# Altium schematic sheet BLOCK DIAGRAM.SchDoc
size A1; DocumentNumber: 14; SheetNumber: 1; SheetTotal: 14
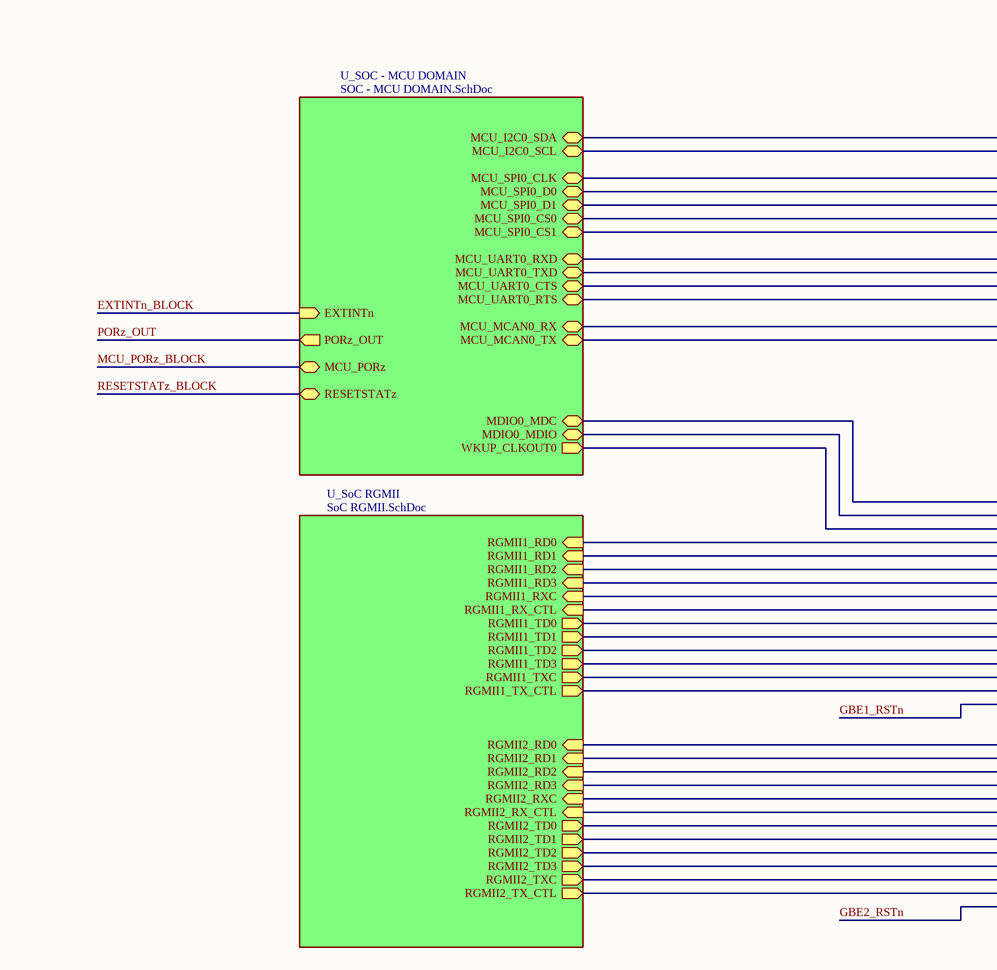
[diagram p0: BLOCK DIAGRAM.SchDoc, top left]
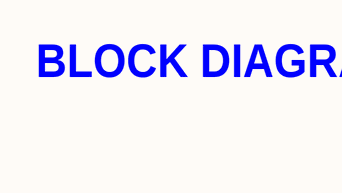
[diagram p1: BLOCK DIAGRAM.SchDoc, top right]
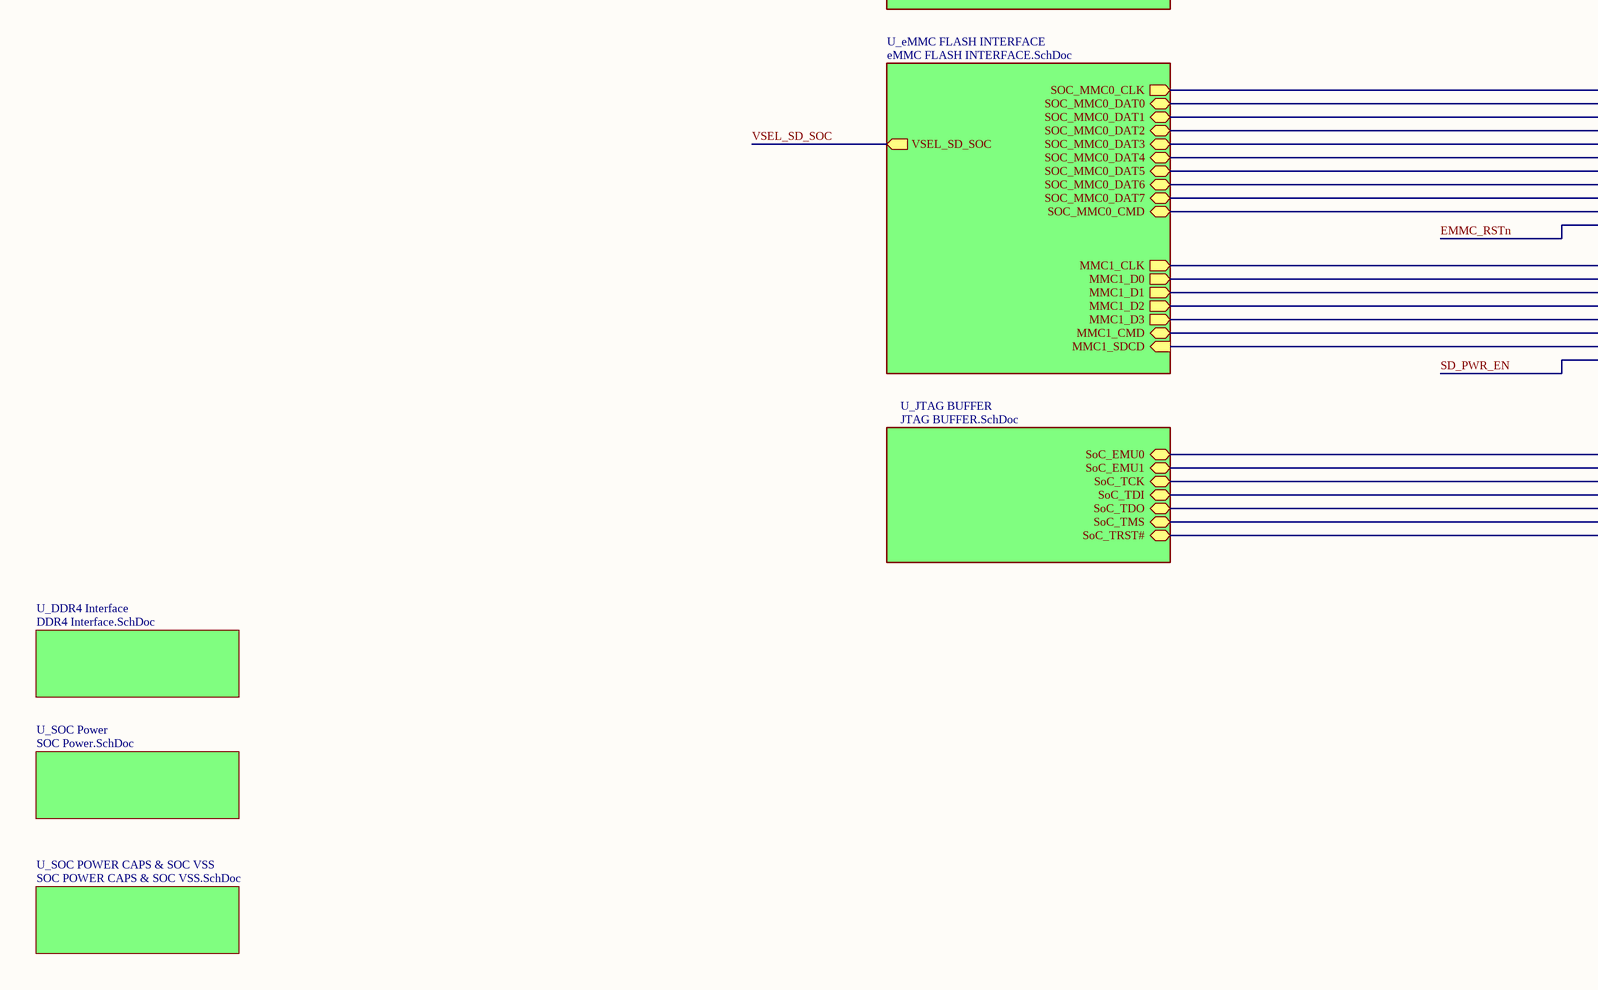
[diagram p2: BLOCK DIAGRAM.SchDoc, bottom left]
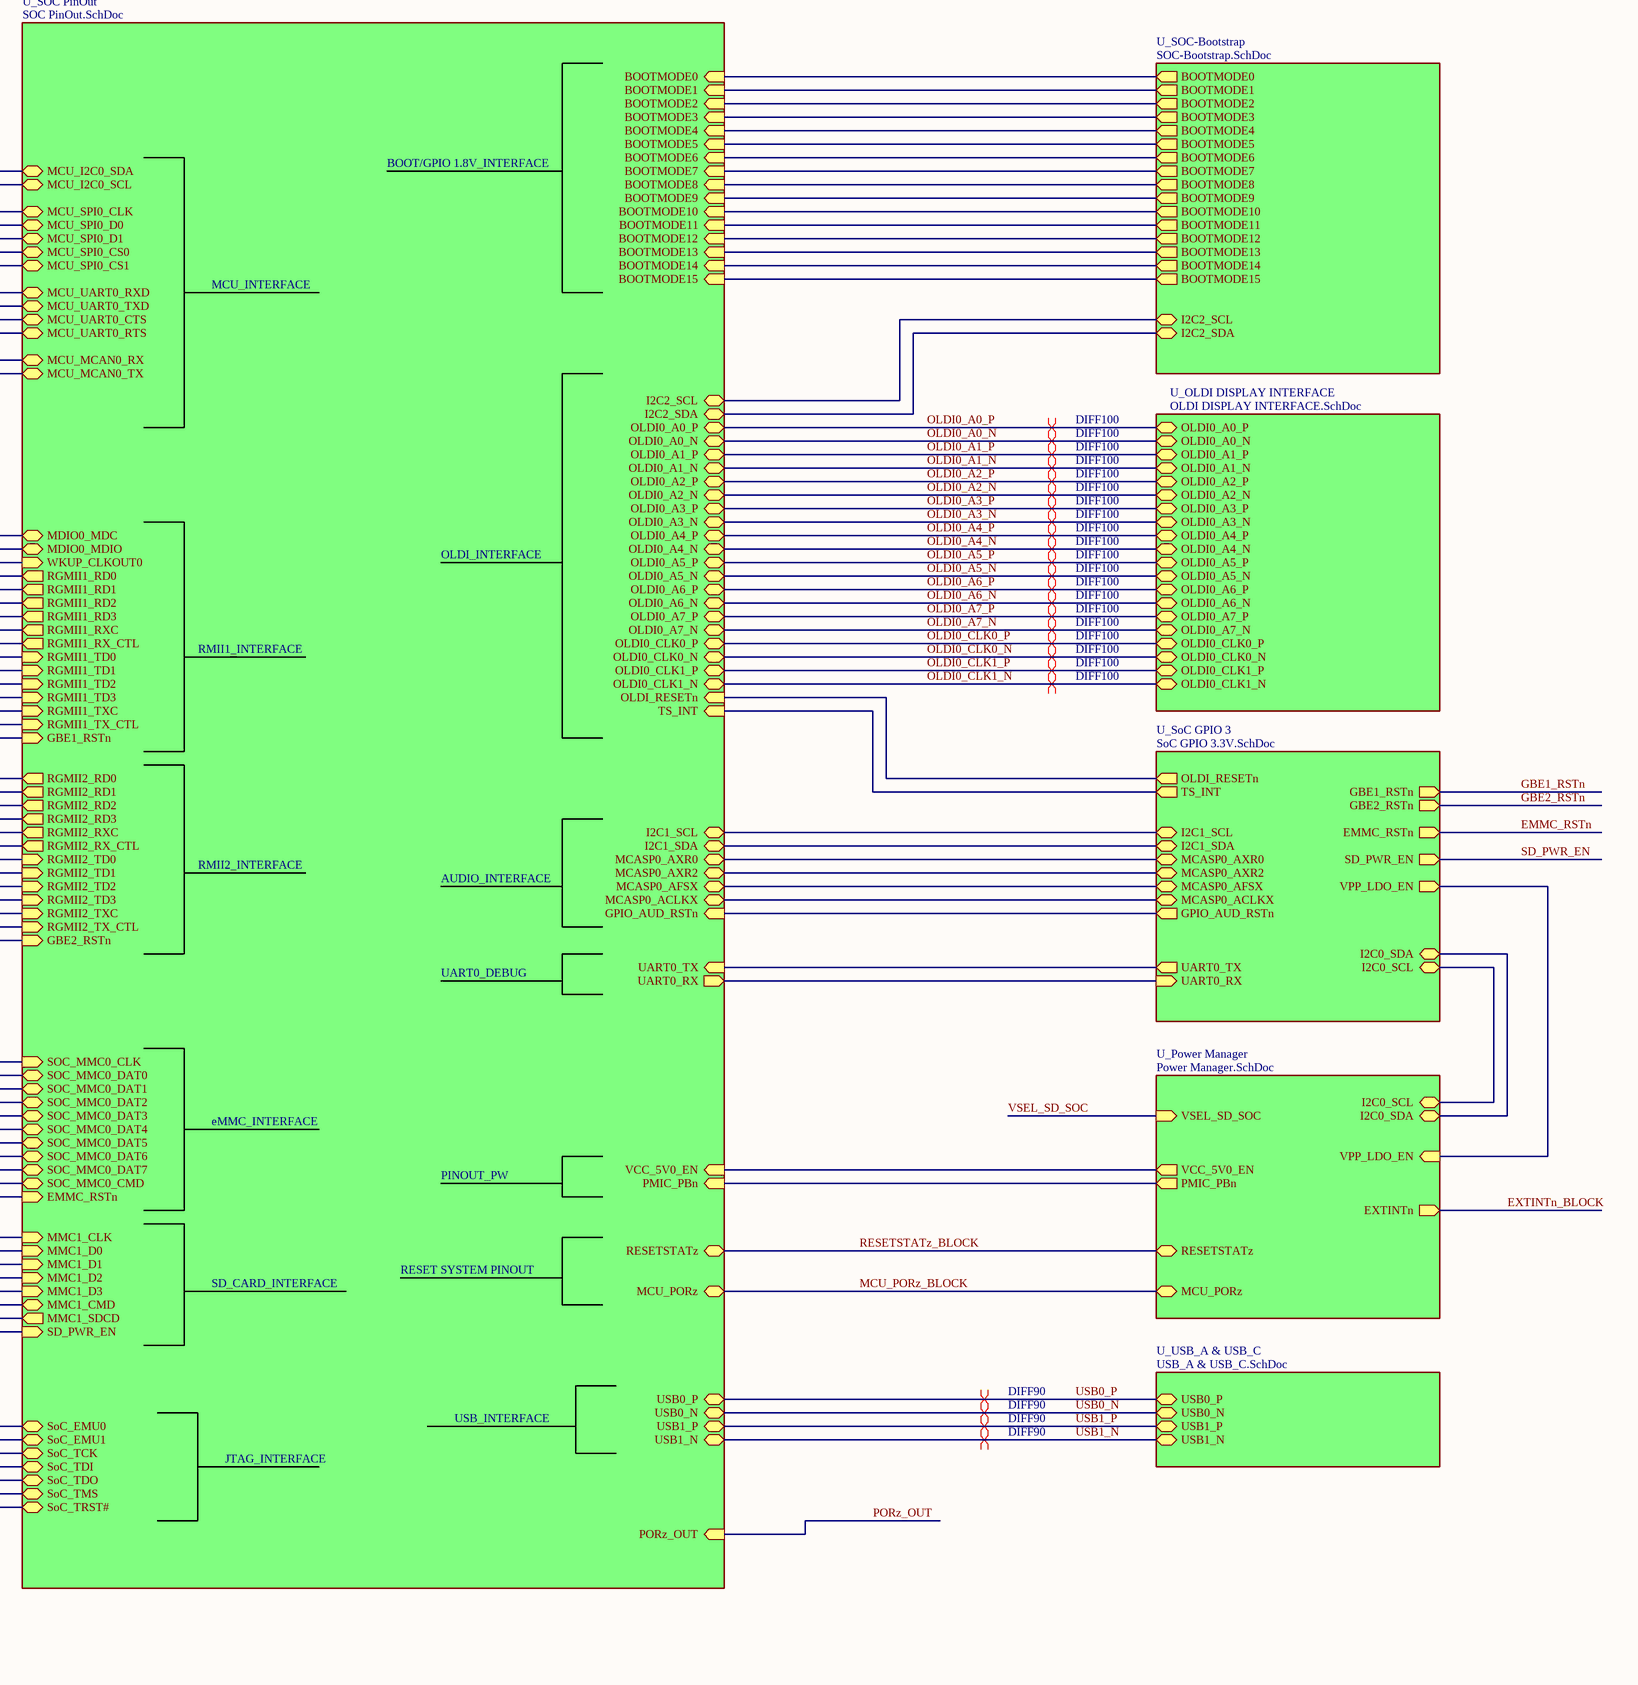
[diagram p3: BLOCK DIAGRAM.SchDoc, bottom right]

## Sub-sheets
U_DDR4 Interface = DDR4 Interface.SchDoc: no entries
U_eMMC FLASH INTERFACE = eMMC FLASH INTERFACE.SchDoc: SOC_MMC0_CLK (out), SOC_MMC0_DAT0 (bidir), SOC_MMC0_DAT1 (bidir), SOC_MMC0_DAT2 (bidir), SOC_MMC0_DAT3 (bidir), SOC_MMC0_DAT4 (bidir), SOC_MMC0_DAT5 (bidir), SOC_MMC0_DAT6 (bidir), SOC_MMC0_DAT7 (bidir), SOC_MMC0_CMD (bidir), VSEL_SD_SOC (out), MMC1_CMD (bidir), MMC1_D1 (out), MMC1_D0 (out), MMC1_SDCD (in), MMC1_D3 (out), MMC1_CLK (out), MMC1_D2 (out)
U_JTAG BUFFER = JTAG BUFFER.SchDoc: SoC_EMU0 (bidir), SoC_EMU1 (bidir), SoC_TCK (bidir), SoC_TDI (bidir), SoC_TDO (bidir), SoC_TMS (bidir), SoC_TRST# (bidir)
U_OLDI DISPLAY INTERFACE = OLDI DISPLAY INTERFACE.SchDoc: OLDI0_A0_P (bidir), OLDI0_A0_N (bidir), OLDI0_A1_P (bidir), OLDI0_A1_N (bidir), OLDI0_A2_P (bidir), OLDI0_A2_N (bidir), OLDI0_A3_P (bidir), OLDI0_A3_N (bidir), OLDI0_A4_P (bidir), OLDI0_A4_N (bidir), OLDI0_A5_P (bidir), OLDI0_A5_N (bidir), OLDI0_A6_P (bidir), OLDI0_A6_N (bidir), OLDI0_A7_P (bidir), OLDI0_A7_N (bidir), OLDI0_CLK0_P (bidir), OLDI0_CLK0_N (bidir), OLDI0_CLK1_P (bidir), OLDI0_CLK1_N (bidir)
U_Power Manager = Power Manager.SchDoc: VCC_5V0_EN (out), VSEL_SD_SOC (in), RESETSTATz (bidir), VPP_LDO_EN (in), MCU_PORz (bidir), EXTINTn (out), I2C0_SDA (bidir), I2C0_SCL (bidir), PMIC_PBn (out)
U_SOC - MCU DOMAIN = SOC - MCU DOMAIN.SchDoc: MDIO0_MDC (bidir), MDIO0_MDIO (bidir), WKUP_CLKOUT0 (out), MCU_I2C0_SCL (bidir), MCU_I2C0_SDA (bidir), MCU_SPI0_CLK (bidir), MCU_SPI0_D0 (bidir), MCU_SPI0_D1 (bidir), MCU_SPI0_CS0 (bidir), MCU_SPI0_CS1 (bidir), MCU_UART0_RXD (bidir), MCU_UART0_TXD (bidir), MCU_UART0_CTS (bidir), MCU_UART0_RTS (bidir), MCU_MCAN0_RX (bidir), MCU_MCAN0_TX (bidir), MCU_PORz (bidir), EXTINTn (in), PORz_OUT (out), RESETSTATz (bidir)
U_SoC GPIO 3 = SoC GPIO 3.3V.SchDoc: OLDI_RESETn (out), I2C0_SDA (bidir), I2C0_SCL (bidir), I2C1_SDA (bidir), I2C1_SCL (bidir), EMMC_RSTn (out), VPP_LDO_EN (out), MCASP0_ACLKX (bidir), MCASP0_AXR2 (bidir), MCASP0_AXR0 (bidir), MCASP0_AFSX (bidir), GPIO_AUD_RSTn (out), TS_INT (out), UART0_RX (in), UART0_TX (out), SD_PWR_EN (out), GBE2_RSTn (out), GBE1_RSTn (out)
U_SOC PinOut = SOC PinOut.SchDoc: VCC_5V0_EN (in), SOC_MMC0_CLK (in), SOC_MMC0_DAT0 (bidir), SOC_MMC0_DAT1 (bidir), SOC_MMC0_DAT2 (bidir), SOC_MMC0_DAT3 (bidir), SOC_MMC0_DAT4 (bidir), SOC_MMC0_DAT5 (bidir), SOC_MMC0_DAT6 (bidir), SOC_MMC0_DAT7 (bidir), SOC_MMC0_CMD (bidir), EMMC_RSTn (in), SoC_EMU0 (bidir), SoC_EMU1 (bidir), SoC_TCK (bidir), SoC_TDO (bidir), SoC_TRST# (bidir), MCU_I2C0_SCL (bidir), MCU_I2C0_SDA (bidir), MCU_SPI0_CLK (bidir), MCU_SPI0_D0 (bidir), MCU_SPI0_D1 (bidir), MCU_SPI0_CS0 (bidir), MCU_SPI0_CS1 (bidir), MCU_UART0_RXD (bidir), MCU_UART0_TXD (bidir), MCU_UART0_CTS (bidir), MCU_UART0_RTS (bidir), MCU_MCAN0_RX (bidir), MCU_MCAN0_TX (bidir), OLDI0_A0_P (bidir), OLDI0_A0_N (bidir), OLDI0_A1_P (bidir), OLDI0_A1_N (bidir), OLDI0_A2_P (bidir), OLDI0_A2_N (bidir), OLDI0_A3_P (bidir), OLDI0_A3_N (bidir), OLDI0_A4_P (bidir), OLDI0_A4_N (bidir), OLDI0_A5_P (bidir), OLDI0_A5_N (bidir), OLDI0_A6_P (bidir), OLDI0_A6_N (bidir), OLDI0_A7_P (bidir), OLDI0_A7_N (bidir), OLDI0_CLK0_P (bidir), OLDI0_CLK0_N (bidir), OLDI0_CLK1_P (bidir), OLDI0_CLK1_N (bidir), I2C2_SCL (bidir), I2C2_SDA (bidir), RGMII1_RD0 (out), RGMII1_RD1 (out), RGMII1_RD2 (out), RGMII1_RD3 (out), RGMII1_RXC (out), RGMII1_RX_CTL (out), RGMII1_TD0 (in), RGMII1_TXC (in), RGMII1_TX_CTL (in), RGMII1_TD1 (in), RGMII1_TD2 (in), RGMII1_TD3 (in), MDIO0_MDC (bidir), MDIO0_MDIO (bidir), WKUP_CLKOUT0 (in), BOOTMODE0 (in), BOOTMODE1 (in), BOOTMODE2 (in), BOOTMODE3 (in), BOOTMODE4 (in), BOOTMODE5 (in), BOOTMODE6 (in), BOOTMODE7 (in), BOOTMODE8 (in), BOOTMODE9 (in), BOOTMODE10 (in), BOOTMODE11 (in), BOOTMODE12 (in), BOOTMODE13 (in), BOOTMODE14 (in), BOOTMODE15 (in), PORz_OUT (in), RESETSTATz (bidir), USB0_P (bidir), USB0_N (bidir), I2C1_SDA (bidir), I2C1_SCL (bidir), MCASP0_ACLKX (bidir), MCASP0_AXR2 (bidir), MCASP0_AXR0 (bidir), MCASP0_AFSX (bidir), GPIO_AUD_RSTn (in), USB1_P (bidir), USB1_N (bidir), OLDI_RESETn (in), TS_INT (in), UART0_RX (out), UART0_TX (in), RGMII2_TD0 (in), MMC1_CLK (in), RGMII2_RD3 (out), MMC1_D3 (in), MMC1_CMD (bidir), RGMII2_RD0 (out), MMC1_D1 (in), RGMII2_RX_CTL (out), RGMII2_TXC (in), SD_PWR_EN (in), MMC1_D2 (in), MMC1_SDCD (out), RGMII2_RXC (out), RGMII2_RD2 (out), GBE2_RSTn (in), RGMII2_TD2 (in), RGMII2_TD1 (in), RGMII2_TX_CTL (in), MCU_PORz (bidir), RGMII2_TD3 (in), MMC1_D0 (in), RGMII2_RD1 (out), GBE1_RSTn (in), SoC_TDI (bidir), SoC_TMS (bidir), PMIC_PBn (in)
U_SOC Power = SOC Power.SchDoc: no entries
U_SOC POWER CAPS & SOC VSS = SOC POWER CAPS & SOC VSS.SchDoc: no entries
U_SoC RGMII = SoC RGMII.SchDoc: RGMII1_RD0 (in), RGMII1_RD1 (in), RGMII1_RD2 (in), RGMII1_RD3 (in), RGMII1_RXC (in), RGMII1_RX_CTL (in), RGMII1_TD0 (out), RGMII1_TXC (out), RGMII1_TX_CTL (out), RGMII1_TD1 (out), RGMII1_TD2 (out), RGMII1_TD3 (out), RGMII2_RD1 (in), RGMII2_RD0 (in), RGMII2_RXC (in), RGMII2_RD2 (in), RGMII2_TX_CTL (out), RGMII2_TD2 (out), RGMII2_RX_CTL (in), RGMII2_TD1 (out), RGMII2_TD0 (out), RGMII2_TXC (out), RGMII2_TD3 (out), RGMII2_RD3 (in)
U_SOC-Bootstrap = SOC-Bootstrap.SchDoc: BOOTMODE0 (out), BOOTMODE1 (out), BOOTMODE2 (out), BOOTMODE3 (out), BOOTMODE4 (out), BOOTMODE5 (out), BOOTMODE6 (out), BOOTMODE7 (out), BOOTMODE8 (out), BOOTMODE9 (out), BOOTMODE10 (out), BOOTMODE11 (out), BOOTMODE12 (out), BOOTMODE13 (out), BOOTMODE14 (out), BOOTMODE15 (out), I2C2_SCL (bidir), I2C2_SDA (bidir)
U_USB_A & USB_C = USB_A & USB_C.SchDoc: USB0_P (bidir), USB0_N (bidir), USB1_P (bidir), USB1_N (bidir)

## Nets
EMMC_RSTn: sheet U_SOC PinOut/EMMC_RSTn, sheet U_SoC GPIO 3/EMMC_RSTn
EXTINTn_BLOCK: sheet U_Power Manager/EXTINTn, sheet U_SOC - MCU DOMAIN/EXTINTn
GBE1_RSTn: sheet U_SOC PinOut/GBE1_RSTn, sheet U_SoC GPIO 3/GBE1_RSTn
GBE2_RSTn: sheet U_SOC PinOut/GBE2_RSTn, sheet U_SoC GPIO 3/GBE2_RSTn
MCU_PORz_BLOCK: sheet U_Power Manager/MCU_PORz, sheet U_SOC - MCU DOMAIN/MCU_PORz, sheet U_SOC PinOut/MCU_PORz
OLDI0_A0_N: sheet U_SOC PinOut/OLDI0_A0_N, sheet U_OLDI DISPLAY INTERFACE/OLDI0_A0_N
OLDI0_A0_P: sheet U_SOC PinOut/OLDI0_A0_P, sheet U_OLDI DISPLAY INTERFACE/OLDI0_A0_P
OLDI0_A1_N: sheet U_SOC PinOut/OLDI0_A1_N, sheet U_OLDI DISPLAY INTERFACE/OLDI0_A1_N
OLDI0_A1_P: sheet U_SOC PinOut/OLDI0_A1_P, sheet U_OLDI DISPLAY INTERFACE/OLDI0_A1_P
OLDI0_A2_N: sheet U_SOC PinOut/OLDI0_A2_N, sheet U_OLDI DISPLAY INTERFACE/OLDI0_A2_N
OLDI0_A2_P: sheet U_SOC PinOut/OLDI0_A2_P, sheet U_OLDI DISPLAY INTERFACE/OLDI0_A2_P
OLDI0_A3_N: sheet U_SOC PinOut/OLDI0_A3_N, sheet U_OLDI DISPLAY INTERFACE/OLDI0_A3_N
OLDI0_A3_P: sheet U_SOC PinOut/OLDI0_A3_P, sheet U_OLDI DISPLAY INTERFACE/OLDI0_A3_P
OLDI0_A4_N: sheet U_SOC PinOut/OLDI0_A4_N, sheet U_OLDI DISPLAY INTERFACE/OLDI0_A4_N
OLDI0_A4_P: sheet U_SOC PinOut/OLDI0_A4_P, sheet U_OLDI DISPLAY INTERFACE/OLDI0_A4_P
OLDI0_A5_N: sheet U_SOC PinOut/OLDI0_A5_N, sheet U_OLDI DISPLAY INTERFACE/OLDI0_A5_N
OLDI0_A5_P: sheet U_SOC PinOut/OLDI0_A5_P, sheet U_OLDI DISPLAY INTERFACE/OLDI0_A5_P
OLDI0_A6_N: sheet U_SOC PinOut/OLDI0_A6_N, sheet U_OLDI DISPLAY INTERFACE/OLDI0_A6_N
OLDI0_A6_P: sheet U_SOC PinOut/OLDI0_A6_P, sheet U_OLDI DISPLAY INTERFACE/OLDI0_A6_P
OLDI0_A7_N: sheet U_SOC PinOut/OLDI0_A7_N, sheet U_OLDI DISPLAY INTERFACE/OLDI0_A7_N
OLDI0_A7_P: sheet U_SOC PinOut/OLDI0_A7_P, sheet U_OLDI DISPLAY INTERFACE/OLDI0_A7_P
OLDI0_CLK0_N: sheet U_SOC PinOut/OLDI0_CLK0_N, sheet U_OLDI DISPLAY INTERFACE/OLDI0_CLK0_N
OLDI0_CLK0_P: sheet U_SOC PinOut/OLDI0_CLK0_P, sheet U_OLDI DISPLAY INTERFACE/OLDI0_CLK0_P
OLDI0_CLK1_N: sheet U_SOC PinOut/OLDI0_CLK1_N, sheet U_OLDI DISPLAY INTERFACE/OLDI0_CLK1_N
OLDI0_CLK1_P: sheet U_SOC PinOut/OLDI0_CLK1_P, sheet U_OLDI DISPLAY INTERFACE/OLDI0_CLK1_P
PORz_OUT: sheet U_SOC - MCU DOMAIN/PORz_OUT, sheet U_SOC PinOut/PORz_OUT
RESETSTATz_BLOCK: sheet U_Power Manager/RESETSTATz, sheet U_SOC - MCU DOMAIN/RESETSTATz, sheet U_SOC PinOut/RESETSTATz
SD_PWR_EN: sheet U_SOC PinOut/SD_PWR_EN, sheet U_SoC GPIO 3/SD_PWR_EN
USB0_N: sheet U_SOC PinOut/USB0_N, sheet U_USB_A & USB_C/USB0_N
USB0_P: sheet U_SOC PinOut/USB0_P, sheet U_USB_A & USB_C/USB0_P
USB1_N: sheet U_SOC PinOut/USB1_N, sheet U_USB_A & USB_C/USB1_N
USB1_P: sheet U_SOC PinOut/USB1_P, sheet U_USB_A & USB_C/USB1_P
VSEL_SD_SOC: sheet U_Power Manager/VSEL_SD_SOC, sheet U_eMMC FLASH INTERFACE/VSEL_SD_SOC
(unnamed): sheet U_Power Manager/VCC_5V0_EN, sheet U_SOC PinOut/VCC_5V0_EN
(unnamed): sheet U_Power Manager/VPP_LDO_EN, sheet U_SoC GPIO 3/VPP_LDO_EN
(unnamed): sheet U_Power Manager/I2C0_SDA, sheet U_SoC GPIO 3/I2C0_SDA
(unnamed): sheet U_Power Manager/I2C0_SCL, sheet U_SoC GPIO 3/I2C0_SCL
(unnamed): sheet U_Power Manager/PMIC_PBn, sheet U_SOC PinOut/PMIC_PBn
(unnamed): sheet U_SOC - MCU DOMAIN/MDIO0_MDC, sheet U_SOC PinOut/MDIO0_MDC
(unnamed): sheet U_SOC - MCU DOMAIN/MDIO0_MDIO, sheet U_SOC PinOut/MDIO0_MDIO
(unnamed): sheet U_SOC - MCU DOMAIN/WKUP_CLKOUT0, sheet U_SOC PinOut/WKUP_CLKOUT0
(unnamed): sheet U_SOC - MCU DOMAIN/MCU_I2C0_SCL, sheet U_SOC PinOut/MCU_I2C0_SCL
(unnamed): sheet U_SOC - MCU DOMAIN/MCU_I2C0_SDA, sheet U_SOC PinOut/MCU_I2C0_SDA
(unnamed): sheet U_SOC - MCU DOMAIN/MCU_SPI0_CLK, sheet U_SOC PinOut/MCU_SPI0_CLK
(unnamed): sheet U_SOC - MCU DOMAIN/MCU_SPI0_D0, sheet U_SOC PinOut/MCU_SPI0_D0
(unnamed): sheet U_SOC - MCU DOMAIN/MCU_SPI0_D1, sheet U_SOC PinOut/MCU_SPI0_D1
(unnamed): sheet U_SOC - MCU DOMAIN/MCU_SPI0_CS0, sheet U_SOC PinOut/MCU_SPI0_CS0
(unnamed): sheet U_SOC - MCU DOMAIN/MCU_SPI0_CS1, sheet U_SOC PinOut/MCU_SPI0_CS1
(unnamed): sheet U_SOC - MCU DOMAIN/MCU_UART0_RXD, sheet U_SOC PinOut/MCU_UART0_RXD
(unnamed): sheet U_SOC - MCU DOMAIN/MCU_UART0_TXD, sheet U_SOC PinOut/MCU_UART0_TXD
(unnamed): sheet U_SOC - MCU DOMAIN/MCU_UART0_CTS, sheet U_SOC PinOut/MCU_UART0_CTS
(unnamed): sheet U_SOC - MCU DOMAIN/MCU_UART0_RTS, sheet U_SOC PinOut/MCU_UART0_RTS
(unnamed): sheet U_SOC - MCU DOMAIN/MCU_MCAN0_RX, sheet U_SOC PinOut/MCU_MCAN0_RX
(unnamed): sheet U_SOC - MCU DOMAIN/MCU_MCAN0_TX, sheet U_SOC PinOut/MCU_MCAN0_TX
(unnamed): sheet U_SOC PinOut/SOC_MMC0_CLK, sheet U_eMMC FLASH INTERFACE/SOC_MMC0_CLK
(unnamed): sheet U_SOC PinOut/SOC_MMC0_DAT0, sheet U_eMMC FLASH INTERFACE/SOC_MMC0_DAT0
(unnamed): sheet U_SOC PinOut/SOC_MMC0_DAT1, sheet U_eMMC FLASH INTERFACE/SOC_MMC0_DAT1
(unnamed): sheet U_SOC PinOut/SOC_MMC0_DAT2, sheet U_eMMC FLASH INTERFACE/SOC_MMC0_DAT2
(unnamed): sheet U_SOC PinOut/SOC_MMC0_DAT3, sheet U_eMMC FLASH INTERFACE/SOC_MMC0_DAT3
(unnamed): sheet U_SOC PinOut/SOC_MMC0_DAT4, sheet U_eMMC FLASH INTERFACE/SOC_MMC0_DAT4
(unnamed): sheet U_SOC PinOut/SOC_MMC0_DAT5, sheet U_eMMC FLASH INTERFACE/SOC_MMC0_DAT5
(unnamed): sheet U_SOC PinOut/SOC_MMC0_DAT6, sheet U_eMMC FLASH INTERFACE/SOC_MMC0_DAT6
(unnamed): sheet U_SOC PinOut/SOC_MMC0_DAT7, sheet U_eMMC FLASH INTERFACE/SOC_MMC0_DAT7
(unnamed): sheet U_SOC PinOut/SOC_MMC0_CMD, sheet U_eMMC FLASH INTERFACE/SOC_MMC0_CMD
(unnamed): sheet U_SOC PinOut/SoC_EMU0, sheet U_JTAG BUFFER/SoC_EMU0
(unnamed): sheet U_SOC PinOut/SoC_EMU1, sheet U_JTAG BUFFER/SoC_EMU1
(unnamed): sheet U_SOC PinOut/SoC_TCK, sheet U_JTAG BUFFER/SoC_TCK
(unnamed): sheet U_SOC PinOut/SoC_TDO, sheet U_JTAG BUFFER/SoC_TDO
(unnamed): sheet U_SOC PinOut/SoC_TRST#, sheet U_JTAG BUFFER/SoC_TRST#
(unnamed): sheet U_SOC PinOut/I2C2_SCL, sheet U_SOC-Bootstrap/I2C2_SCL
(unnamed): sheet U_SOC PinOut/I2C2_SDA, sheet U_SOC-Bootstrap/I2C2_SDA
(unnamed): sheet U_SOC PinOut/RGMII1_RD0, sheet U_SoC RGMII/RGMII1_RD0
(unnamed): sheet U_SOC PinOut/RGMII1_RD1, sheet U_SoC RGMII/RGMII1_RD1
(unnamed): sheet U_SOC PinOut/RGMII1_RD2, sheet U_SoC RGMII/RGMII1_RD2
(unnamed): sheet U_SOC PinOut/RGMII1_RD3, sheet U_SoC RGMII/RGMII1_RD3
(unnamed): sheet U_SOC PinOut/RGMII1_RXC, sheet U_SoC RGMII/RGMII1_RXC
(unnamed): sheet U_SOC PinOut/RGMII1_RX_CTL, sheet U_SoC RGMII/RGMII1_RX_CTL
(unnamed): sheet U_SOC PinOut/RGMII1_TD0, sheet U_SoC RGMII/RGMII1_TD0
(unnamed): sheet U_SOC PinOut/RGMII1_TXC, sheet U_SoC RGMII/RGMII1_TXC
(unnamed): sheet U_SOC PinOut/RGMII1_TX_CTL, sheet U_SoC RGMII/RGMII1_TX_CTL
(unnamed): sheet U_SOC PinOut/RGMII1_TD1, sheet U_SoC RGMII/RGMII1_TD1
(unnamed): sheet U_SOC PinOut/RGMII1_TD2, sheet U_SoC RGMII/RGMII1_TD2
(unnamed): sheet U_SOC PinOut/RGMII1_TD3, sheet U_SoC RGMII/RGMII1_TD3
(unnamed): sheet U_SOC PinOut/BOOTMODE0, sheet U_SOC-Bootstrap/BOOTMODE0
(unnamed): sheet U_SOC PinOut/BOOTMODE1, sheet U_SOC-Bootstrap/BOOTMODE1
(unnamed): sheet U_SOC PinOut/BOOTMODE2, sheet U_SOC-Bootstrap/BOOTMODE2
(unnamed): sheet U_SOC PinOut/BOOTMODE3, sheet U_SOC-Bootstrap/BOOTMODE3
(unnamed): sheet U_SOC PinOut/BOOTMODE4, sheet U_SOC-Bootstrap/BOOTMODE4
(unnamed): sheet U_SOC PinOut/BOOTMODE5, sheet U_SOC-Bootstrap/BOOTMODE5
(unnamed): sheet U_SOC PinOut/BOOTMODE6, sheet U_SOC-Bootstrap/BOOTMODE6
(unnamed): sheet U_SOC PinOut/BOOTMODE7, sheet U_SOC-Bootstrap/BOOTMODE7
(unnamed): sheet U_SOC PinOut/BOOTMODE8, sheet U_SOC-Bootstrap/BOOTMODE8
(unnamed): sheet U_SOC PinOut/BOOTMODE9, sheet U_SOC-Bootstrap/BOOTMODE9
(unnamed): sheet U_SOC PinOut/BOOTMODE10, sheet U_SOC-Bootstrap/BOOTMODE10
(unnamed): sheet U_SOC PinOut/BOOTMODE11, sheet U_SOC-Bootstrap/BOOTMODE11
(unnamed): sheet U_SOC PinOut/BOOTMODE12, sheet U_SOC-Bootstrap/BOOTMODE12
(unnamed): sheet U_SOC PinOut/BOOTMODE13, sheet U_SOC-Bootstrap/BOOTMODE13
(unnamed): sheet U_SOC PinOut/BOOTMODE14, sheet U_SOC-Bootstrap/BOOTMODE14
(unnamed): sheet U_SOC PinOut/BOOTMODE15, sheet U_SOC-Bootstrap/BOOTMODE15
(unnamed): sheet U_SOC PinOut/I2C1_SDA, sheet U_SoC GPIO 3/I2C1_SDA
(unnamed): sheet U_SOC PinOut/I2C1_SCL, sheet U_SoC GPIO 3/I2C1_SCL
(unnamed): sheet U_SOC PinOut/MCASP0_ACLKX, sheet U_SoC GPIO 3/MCASP0_ACLKX
(unnamed): sheet U_SOC PinOut/MCASP0_AXR2, sheet U_SoC GPIO 3/MCASP0_AXR2
(unnamed): sheet U_SOC PinOut/MCASP0_AXR0, sheet U_SoC GPIO 3/MCASP0_AXR0
(unnamed): sheet U_SOC PinOut/MCASP0_AFSX, sheet U_SoC GPIO 3/MCASP0_AFSX
(unnamed): sheet U_SOC PinOut/GPIO_AUD_RSTn, sheet U_SoC GPIO 3/GPIO_AUD_RSTn
(unnamed): sheet U_SOC PinOut/OLDI_RESETn, sheet U_SoC GPIO 3/OLDI_RESETn
(unnamed): sheet U_SOC PinOut/TS_INT, sheet U_SoC GPIO 3/TS_INT
(unnamed): sheet U_SOC PinOut/UART0_RX, sheet U_SoC GPIO 3/UART0_RX
(unnamed): sheet U_SOC PinOut/UART0_TX, sheet U_SoC GPIO 3/UART0_TX
(unnamed): sheet U_SOC PinOut/RGMII2_TD0, sheet U_SoC RGMII/RGMII2_TD0
(unnamed): sheet U_SOC PinOut/MMC1_CLK, sheet U_eMMC FLASH INTERFACE/MMC1_CLK
(unnamed): sheet U_SOC PinOut/RGMII2_RD3, sheet U_SoC RGMII/RGMII2_RD3
(unnamed): sheet U_SOC PinOut/MMC1_D3, sheet U_eMMC FLASH INTERFACE/MMC1_D3
(unnamed): sheet U_SOC PinOut/MMC1_CMD, sheet U_eMMC FLASH INTERFACE/MMC1_CMD
(unnamed): sheet U_SOC PinOut/RGMII2_RD0, sheet U_SoC RGMII/RGMII2_RD0
(unnamed): sheet U_SOC PinOut/MMC1_D1, sheet U_eMMC FLASH INTERFACE/MMC1_D1
(unnamed): sheet U_SOC PinOut/RGMII2_RX_CTL, sheet U_SoC RGMII/RGMII2_RX_CTL
(unnamed): sheet U_SOC PinOut/RGMII2_TXC, sheet U_SoC RGMII/RGMII2_TXC
(unnamed): sheet U_SOC PinOut/MMC1_D2, sheet U_eMMC FLASH INTERFACE/MMC1_D2
(unnamed): sheet U_SOC PinOut/MMC1_SDCD, sheet U_eMMC FLASH INTERFACE/MMC1_SDCD
(unnamed): sheet U_SOC PinOut/RGMII2_RXC, sheet U_SoC RGMII/RGMII2_RXC
(unnamed): sheet U_SOC PinOut/RGMII2_RD2, sheet U_SoC RGMII/RGMII2_RD2
(unnamed): sheet U_SOC PinOut/RGMII2_TD2, sheet U_SoC RGMII/RGMII2_TD2
(unnamed): sheet U_SOC PinOut/RGMII2_TD1, sheet U_SoC RGMII/RGMII2_TD1
(unnamed): sheet U_SOC PinOut/RGMII2_TX_CTL, sheet U_SoC RGMII/RGMII2_TX_CTL
(unnamed): sheet U_SOC PinOut/RGMII2_TD3, sheet U_SoC RGMII/RGMII2_TD3
(unnamed): sheet U_SOC PinOut/MMC1_D0, sheet U_eMMC FLASH INTERFACE/MMC1_D0
(unnamed): sheet U_SOC PinOut/RGMII2_RD1, sheet U_SoC RGMII/RGMII2_RD1
(unnamed): sheet U_SOC PinOut/SoC_TDI, sheet U_JTAG BUFFER/SoC_TDI
(unnamed): sheet U_SOC PinOut/SoC_TMS, sheet U_JTAG BUFFER/SoC_TMS

## Layout directives
differential pair; net class DIFF100: OLDI0_A0_N, OLDI0_A0_P, OLDI0_A1_N, OLDI0_A1_P, OLDI0_A2_N, OLDI0_A2_P, OLDI0_A3_N, OLDI0_A3_P, OLDI0_A4_N, OLDI0_A4_P, OLDI0_A5_N, OLDI0_A5_P, OLDI0_A6_N, OLDI0_A6_P, OLDI0_A7_N, OLDI0_A7_P, OLDI0_CLK0_N, OLDI0_CLK0_P, OLDI0_CLK1_N, OLDI0_CLK1_P
differential pair; net class DIFF90: USB0_N, USB0_P, USB1_N, USB1_P

## Notes on the sheet
- BLOCK DIAGRAM PIN OUT INTERFACE
- BOOT/GPIO 1.8V_INTERFACE
- MCU_INTERFACE
- OLDI_INTERFACE
- RMII1_INTERFACE
- RMII2_INTERFACE
- AUDIO_INTERFACE
- UART0_DEBUG
- eMMC_INTERFACE
- PINOUT_PW
- SD_CARD_INTERFACE
- RESET SYSTEM PINOUT
- USB_INTERFACE
- JTAG_INTERFACE